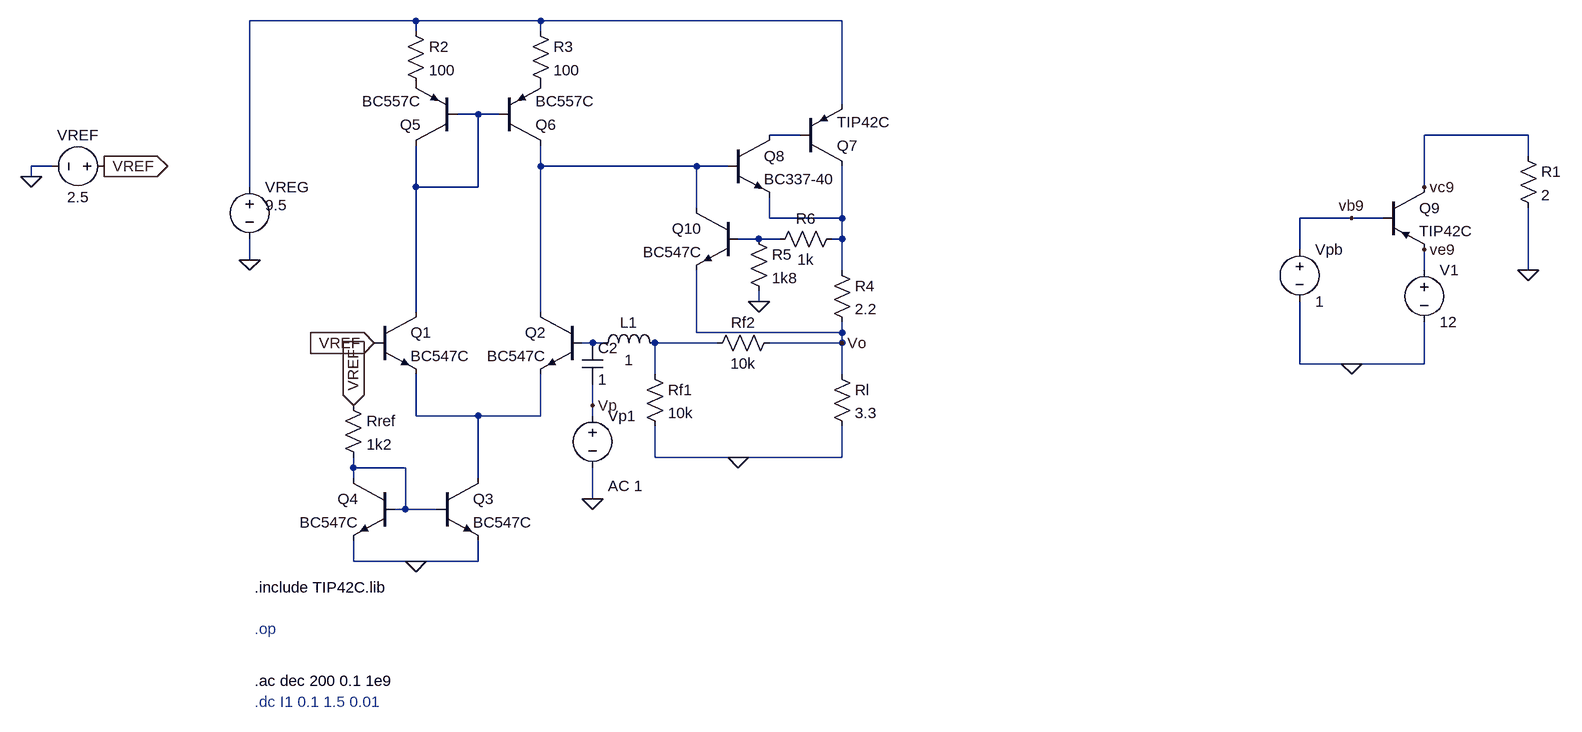
[diagram p0: schematic Circuito_Final.asc]
Circuito_Final.asc, the LTspice schematic file:
Version 4
SHEET 1 2016 920
WIRE 208 -192 -48 -192
WIRE 400 -192 208 -192
WIRE 864 -192 400 -192
WIRE 208 -176 208 -192
WIRE 400 -176 400 -192
WIRE 864 -64 864 -192
WIRE 304 -48 272 -48
WIRE 336 -48 304 -48
WIRE 800 -16 752 -16
WIRE 1920 -16 1760 -16
WIRE 1920 16 1920 -16
WIRE -352 32 -384 32
WIRE 400 32 400 0
WIRE 640 32 400 32
WIRE 688 32 640 32
WIRE -384 48 -384 32
WIRE -48 64 -48 -192
WIRE 208 64 208 0
WIRE 304 64 304 -48
WIRE 304 64 208 64
WIRE 1760 64 1760 -16
WIRE 640 96 640 32
WIRE 752 112 752 80
WIRE 864 112 864 32
WIRE 864 112 752 112
WIRE 1648 112 1568 112
WIRE 1696 112 1648 112
WIRE 736 144 704 144
WIRE 768 144 736 144
WIRE 864 144 864 112
WIRE 864 144 848 144
WIRE 1568 160 1568 112
WIRE -48 176 -48 144
WIRE 864 192 864 144
WIRE 1760 192 1760 160
WIRE 1920 192 1920 96
WIRE 736 240 736 224
WIRE 208 256 208 64
WIRE 400 256 400 32
WIRE 640 288 640 192
WIRE 864 288 864 272
WIRE 864 288 640 288
WIRE 480 304 464 304
WIRE 496 304 480 304
WIRE 672 304 576 304
WIRE 864 304 864 288
WIRE 864 304 752 304
WIRE 1568 336 1568 240
WIRE 1648 336 1568 336
WIRE 1760 336 1760 272
WIRE 1760 336 1648 336
WIRE 576 352 576 304
WIRE 864 352 864 304
WIRE 480 400 480 368
WIRE 208 416 208 352
WIRE 304 416 208 416
WIRE 400 416 400 352
WIRE 400 416 304 416
WIRE 480 416 480 400
WIRE 576 480 576 432
WIRE 704 480 576 480
WIRE 864 480 864 432
WIRE 864 480 704 480
WIRE 112 496 112 480
WIRE 192 496 112 496
WIRE 112 512 112 496
WIRE 304 512 304 416
WIRE 480 544 480 496
WIRE 192 560 192 496
WIRE 192 560 176 560
WIRE 240 560 192 560
WIRE 112 640 112 608
WIRE 208 640 112 640
WIRE 304 640 304 608
WIRE 304 640 208 640
FLAG -272 32 VREF
IOPIN -272 32 Out
FLAG -384 48 0
FLAG 144 304 VREF
IOPIN 144 304 In
FLAG 112 400 VREF
IOPIN 112 400 In
FLAG -48 176 0
FLAG 208 640 0
FLAG 704 480 0
FLAG 1648 336 0
FLAG 1920 192 0
FLAG 1760 64 vc9
FLAG 1760 160 ve9
FLAG 1648 112 vb9
FLAG 864 304 Vo
FLAG 736 240 0
FLAG 480 544 0
FLAG 480 400 Vp
SYMBOL voltage -48 48 R0
WINDOW 3 24 44 Left 2
WINDOW 123 0 0 Left 0
WINDOW 39 0 0 Left 0
SYMATTR Value 9.5
SYMATTR InstName VREG
SYMBOL npn 144 256 R0
SYMATTR InstName Q1
SYMATTR Value BC547C
SYMBOL npn 464 256 M0
SYMATTR InstName Q2
SYMATTR Value BC547C
SYMBOL res 560 336 R0
SYMATTR InstName Rf1
SYMATTR Value 10k
SYMBOL res 768 288 R90
WINDOW 0 0 56 VBottom 2
WINDOW 3 32 56 VTop 2
SYMATTR InstName Rf2
SYMATTR Value 10k
SYMBOL voltage -256 32 R90
WINDOW 0 -32 56 VBottom 2
WINDOW 3 32 56 VTop 2
WINDOW 123 0 0 Left 0
WINDOW 39 0 0 Left 0
SYMATTR InstName VREF
SYMATTR Value 2.5
SYMBOL npn 240 512 R0
SYMATTR InstName Q3
SYMATTR Value BC547C
SYMBOL npn 176 512 M0
SYMATTR InstName Q4
SYMATTR Value BC547C
SYMBOL res 96 384 R0
SYMATTR InstName Rref
SYMATTR Value 1k2
SYMBOL pnp 272 0 R180
SYMATTR InstName Q5
SYMATTR Value BC557C
SYMBOL pnp 336 0 M180
SYMATTR InstName Q6
SYMATTR Value BC557C
SYMBOL pnp 800 32 M180
SYMATTR InstName Q7
SYMATTR Value TIP42C
SYMBOL npn 688 -16 R0
SYMATTR InstName Q8
SYMATTR Value BC337-40
SYMBOL voltage 1568 144 R0
WINDOW 123 0 0 Left 0
WINDOW 39 0 0 Left 0
SYMATTR InstName Vpb
SYMATTR Value 1
SYMBOL pnp 1696 64 R0
SYMATTR InstName Q9
SYMATTR Value TIP42C
SYMBOL voltage 1760 176 R0
WINDOW 123 0 0 Left 0
WINDOW 39 0 0 Left 0
SYMATTR InstName V1
SYMATTR Value 12
SYMBOL res 1904 0 R0
SYMATTR InstName R1
SYMATTR Value 2
SYMBOL npn 704 96 M0
SYMATTR InstName Q10
SYMATTR Value BC547C
SYMBOL res 848 176 R0
SYMATTR InstName R4
SYMATTR Value 2.2
SYMBOL res 720 128 R0
SYMATTR InstName R5
SYMATTR Value 1k8
SYMBOL res 864 128 R90
WINDOW 0 0 56 VBottom 2
WINDOW 3 32 56 VTop 2
SYMATTR InstName R6
SYMATTR Value 1k
SYMBOL res 848 336 R0
SYMATTR InstName Rl
SYMATTR Value 3.3
SYMBOL ind 480 320 R270
WINDOW 0 32 56 VTop 2
WINDOW 3 5 56 VBottom 2
SYMATTR InstName L1
SYMATTR Value 1
SYMBOL voltage 480 400 R0
WINDOW 123 24 124 Left 2
WINDOW 39 0 0 Left 0
SYMATTR Value2 AC 1
SYMATTR InstName Vp1
SYMATTR Value ""
SYMBOL cap 464 304 R0
SYMATTR InstName C2
SYMATTR Value 1
SYMBOL res 192 -192 R0
SYMATTR InstName R2
SYMATTR Value 100
SYMBOL res 384 -192 R0
SYMATTR InstName R3
SYMATTR Value 100
TEXT -40 680 Left 2 !.include TIP42C.lib
TEXT -40 744 Left 2 ;.op
TEXT -40 824 Left 2 !.ac dec 200 0.1 1e9
TEXT -40 856 Left 2 ;.dc I1 0.1 1.5 0.01

The netlist it stands for:
* Circuito_Final.asc
VREG N001 0 9.5
Q1 N002 VREF N009 0 BC547C
Q2 N004 N007 N009 0 BC547C
Rf1 N008 0 10k
Rf2 Vo N008 10k
VREF VREF 0 2.5
Q3 N009 N010 0 0 BC547C
Q4 N010 N010 0 0 BC547C
Rref VREF N010 1k2
Q5 N002 N002 P001 0 BC557C
Q6 N004 N002 P002 0 BC557C
Q7 N005 N003 N001 0 TIP42C
Q8 N003 N004 N005 0 BC337-40
Vpb vb9 0 1
Q9 vc9 vb9 ve9 0 TIP42C
V1 ve9 0 12
R1 vc9 0 2
Q10 N004 N006 Vo 0 BC547C
R4 N005 Vo 2.2
R5 N006 0 1k8
R6 N005 N006 1k
Rl Vo 0 3.3
L1 N007 N008 1
Vp1 Vp 0 AC 1
C2 N007 Vp 1
R2 N001 P001 100
R3 N001 P002 100
.model NPN NPN
.model PNP PNP
.lib standard.bjt
.include TIP42C.lib
* .op
.ac dec 200 0.1 1e9
* .dc I1 0.1 1.5 0.01
.backanno
.end